# Altium schematic sheet ATLAS_XP2V5.Sheet 5.SchDoc: ATLAS_XP2V5
size 558 x 431 mm; Organization: IMP Automatika d.o.o.; Revision: V5
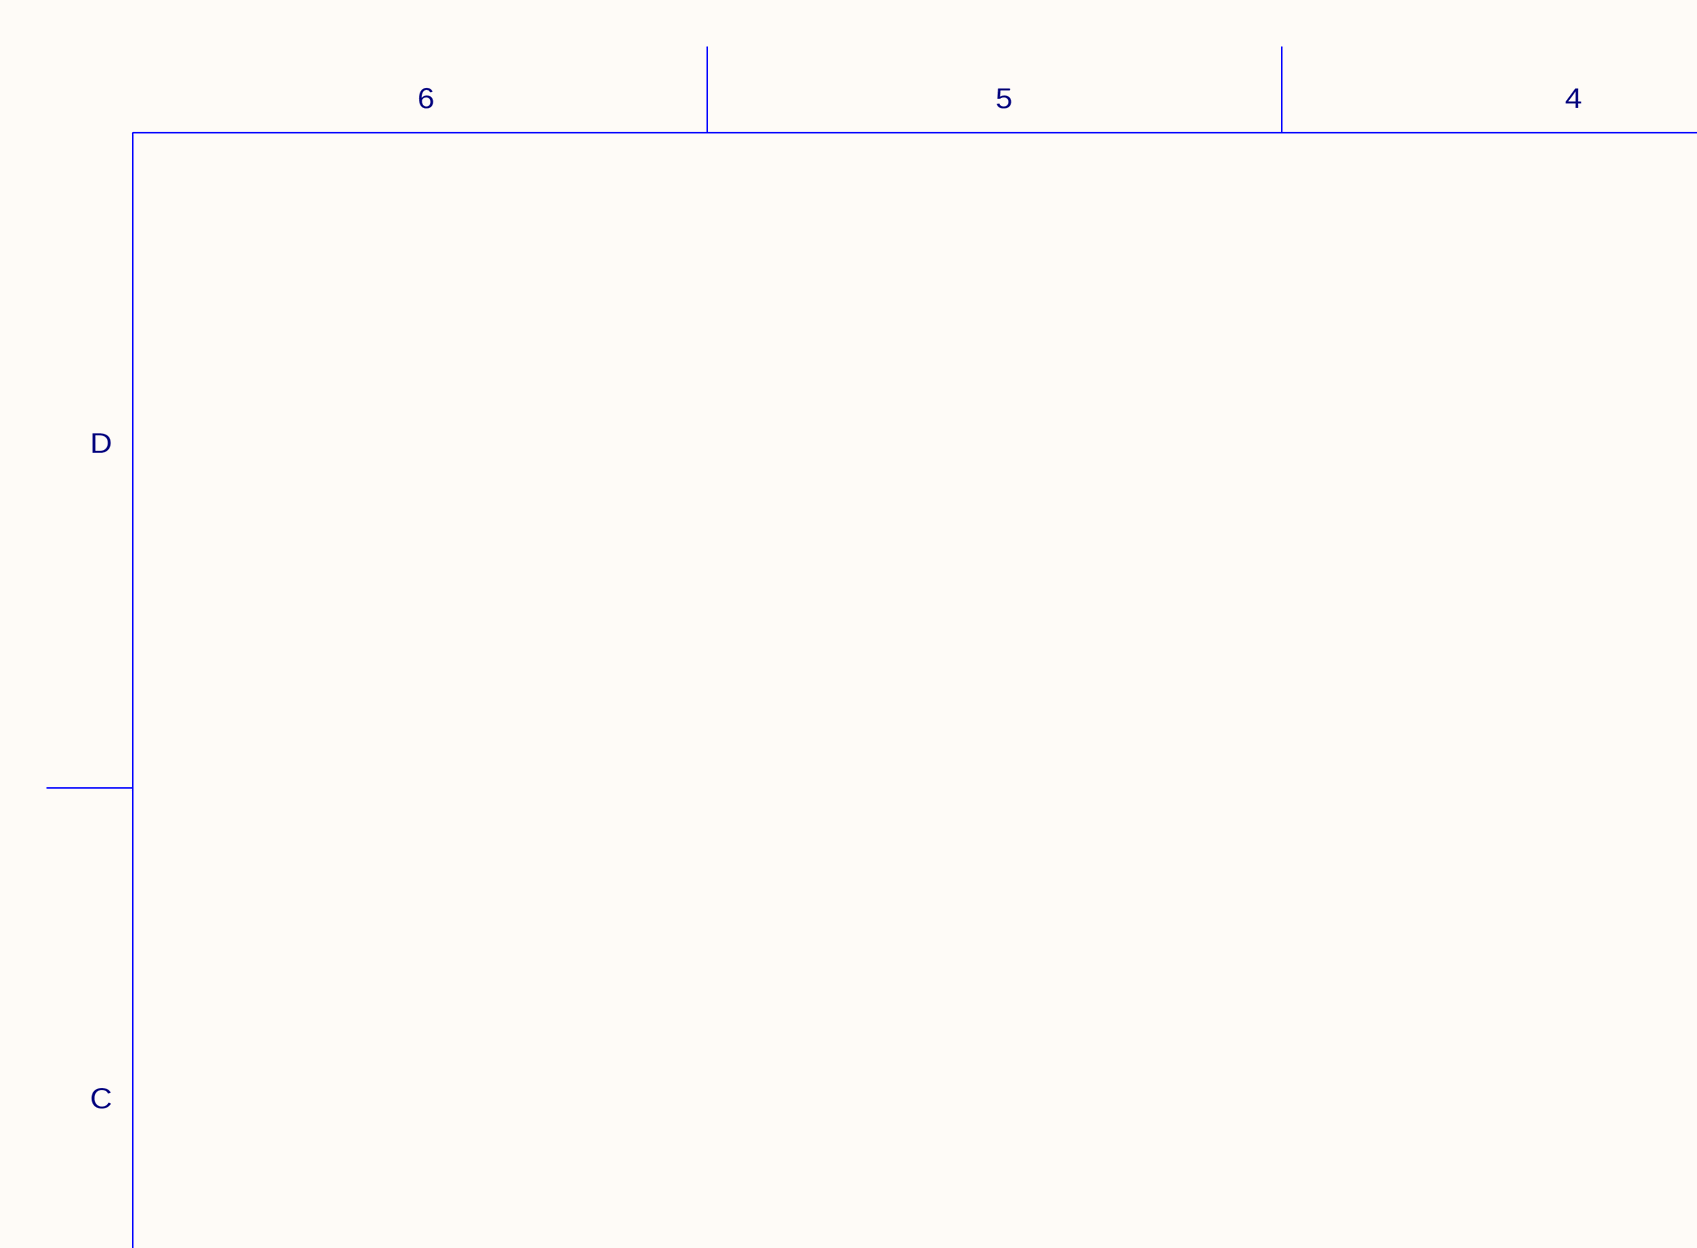
[diagram p0: ATLAS_XP2V5.Sheet 5.SchDoc, top left]
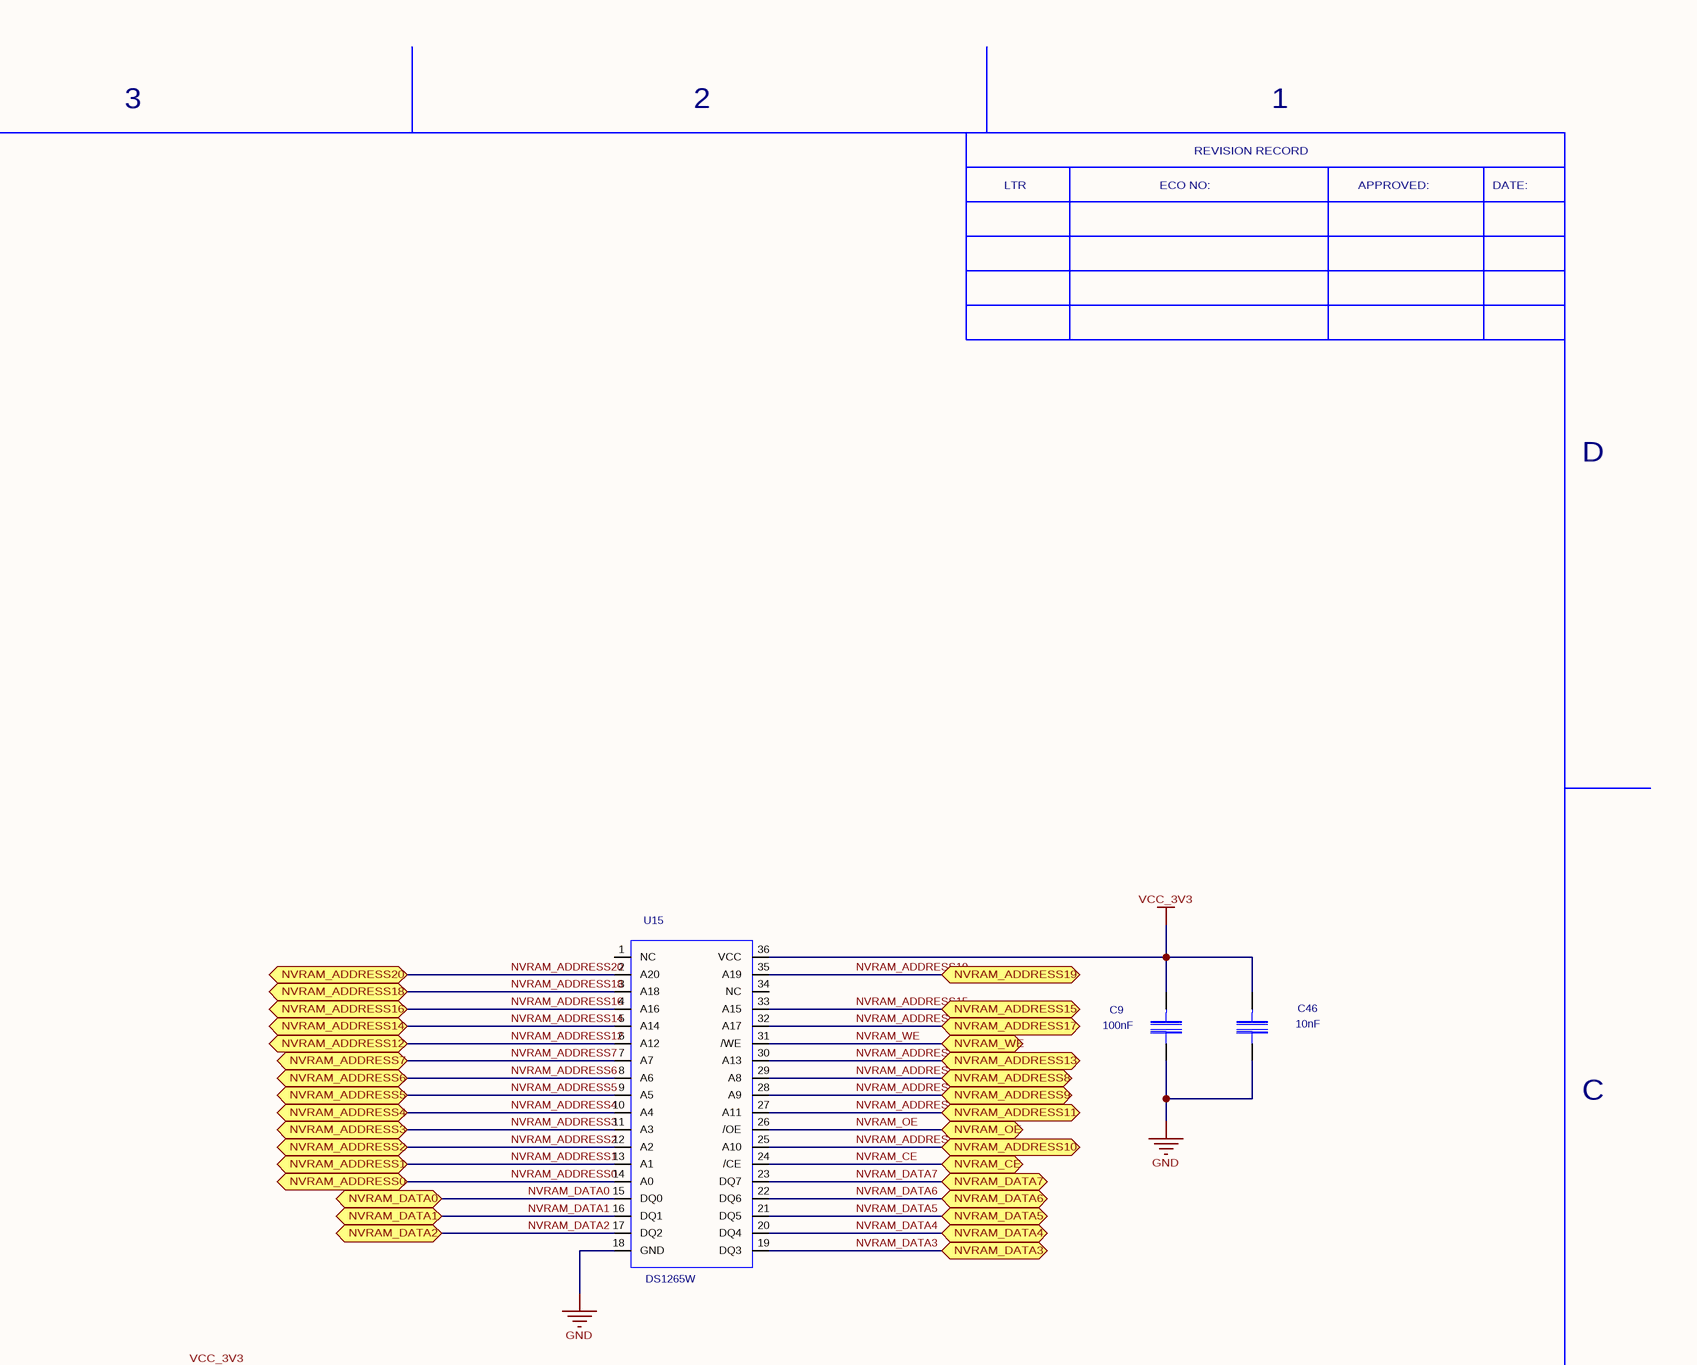
[diagram p1: ATLAS_XP2V5.Sheet 5.SchDoc, top right]
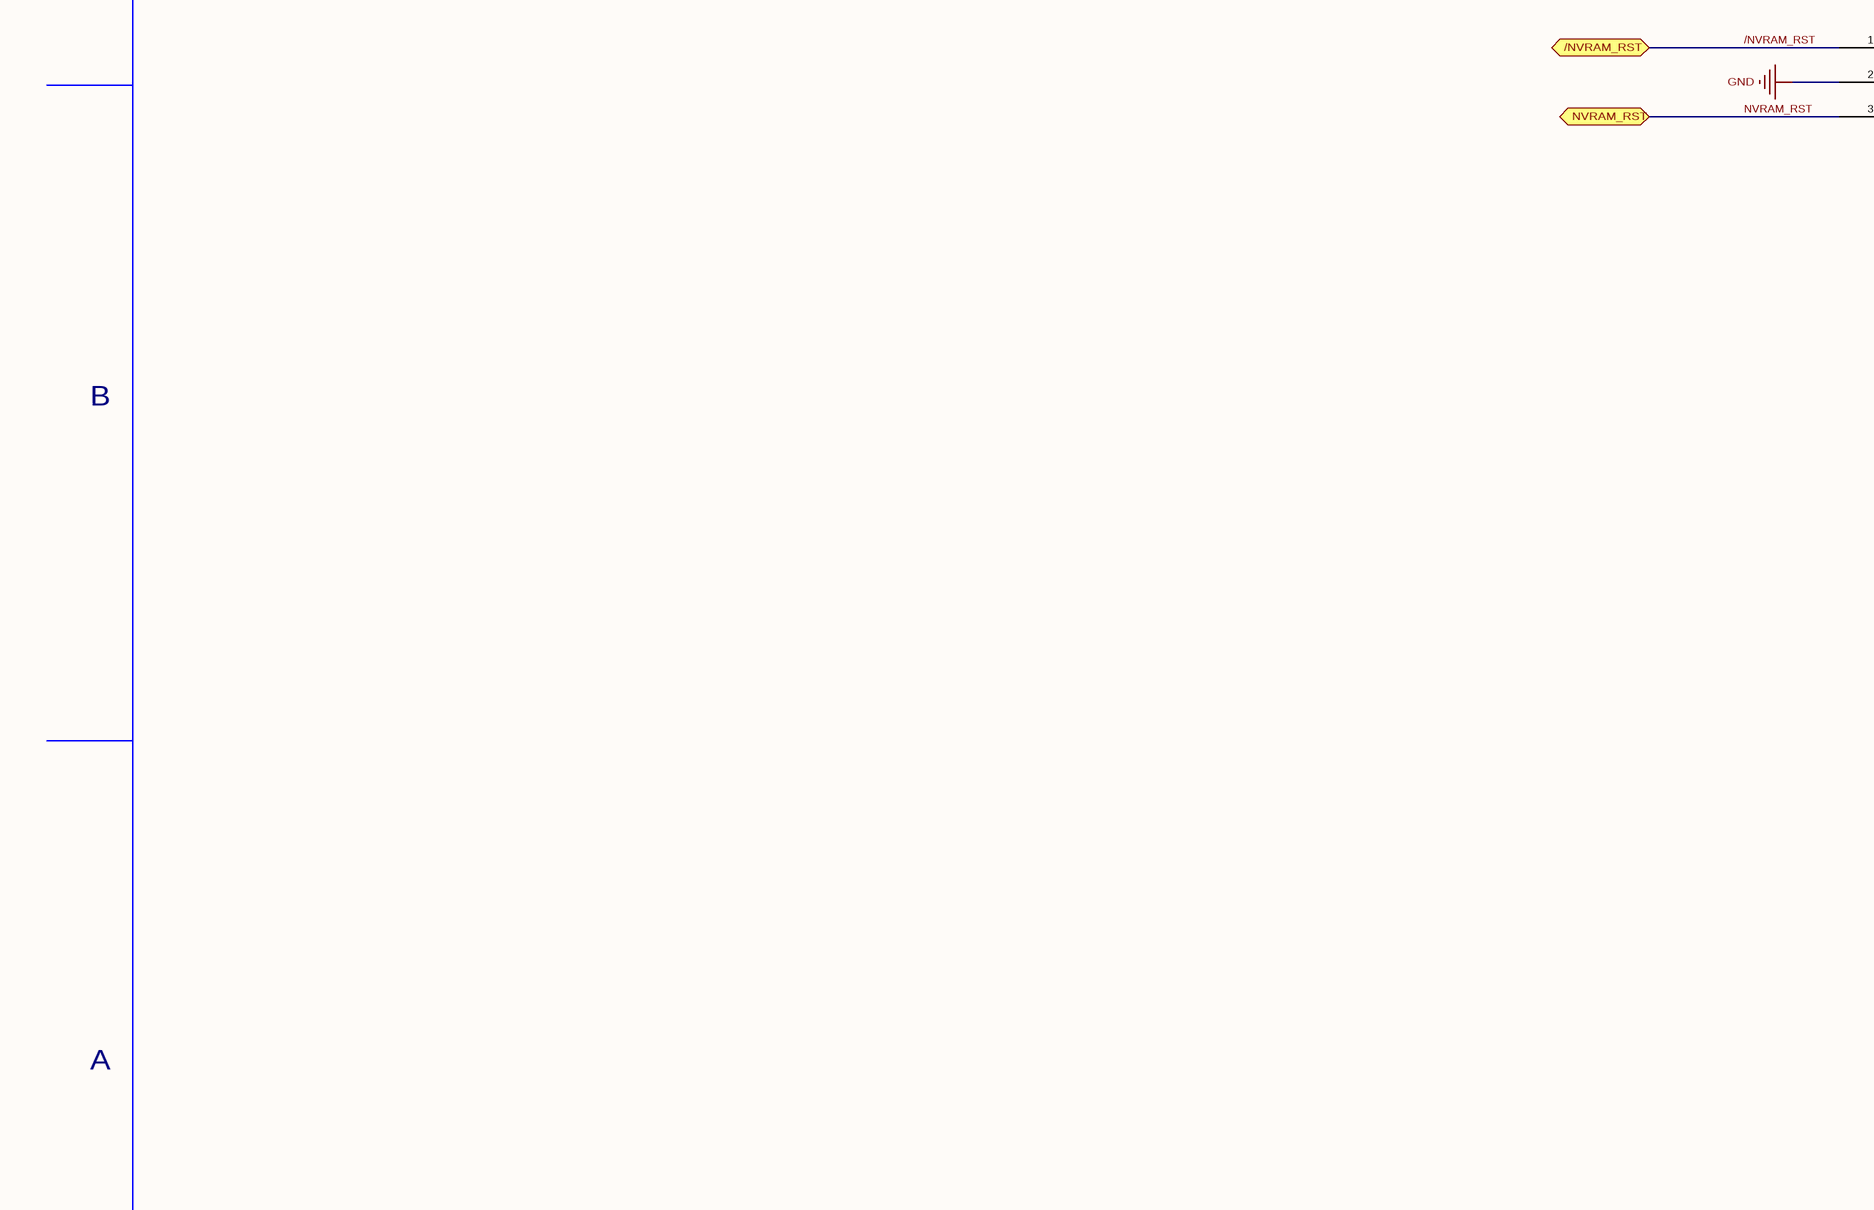
[diagram p2: ATLAS_XP2V5.Sheet 5.SchDoc, bottom left]
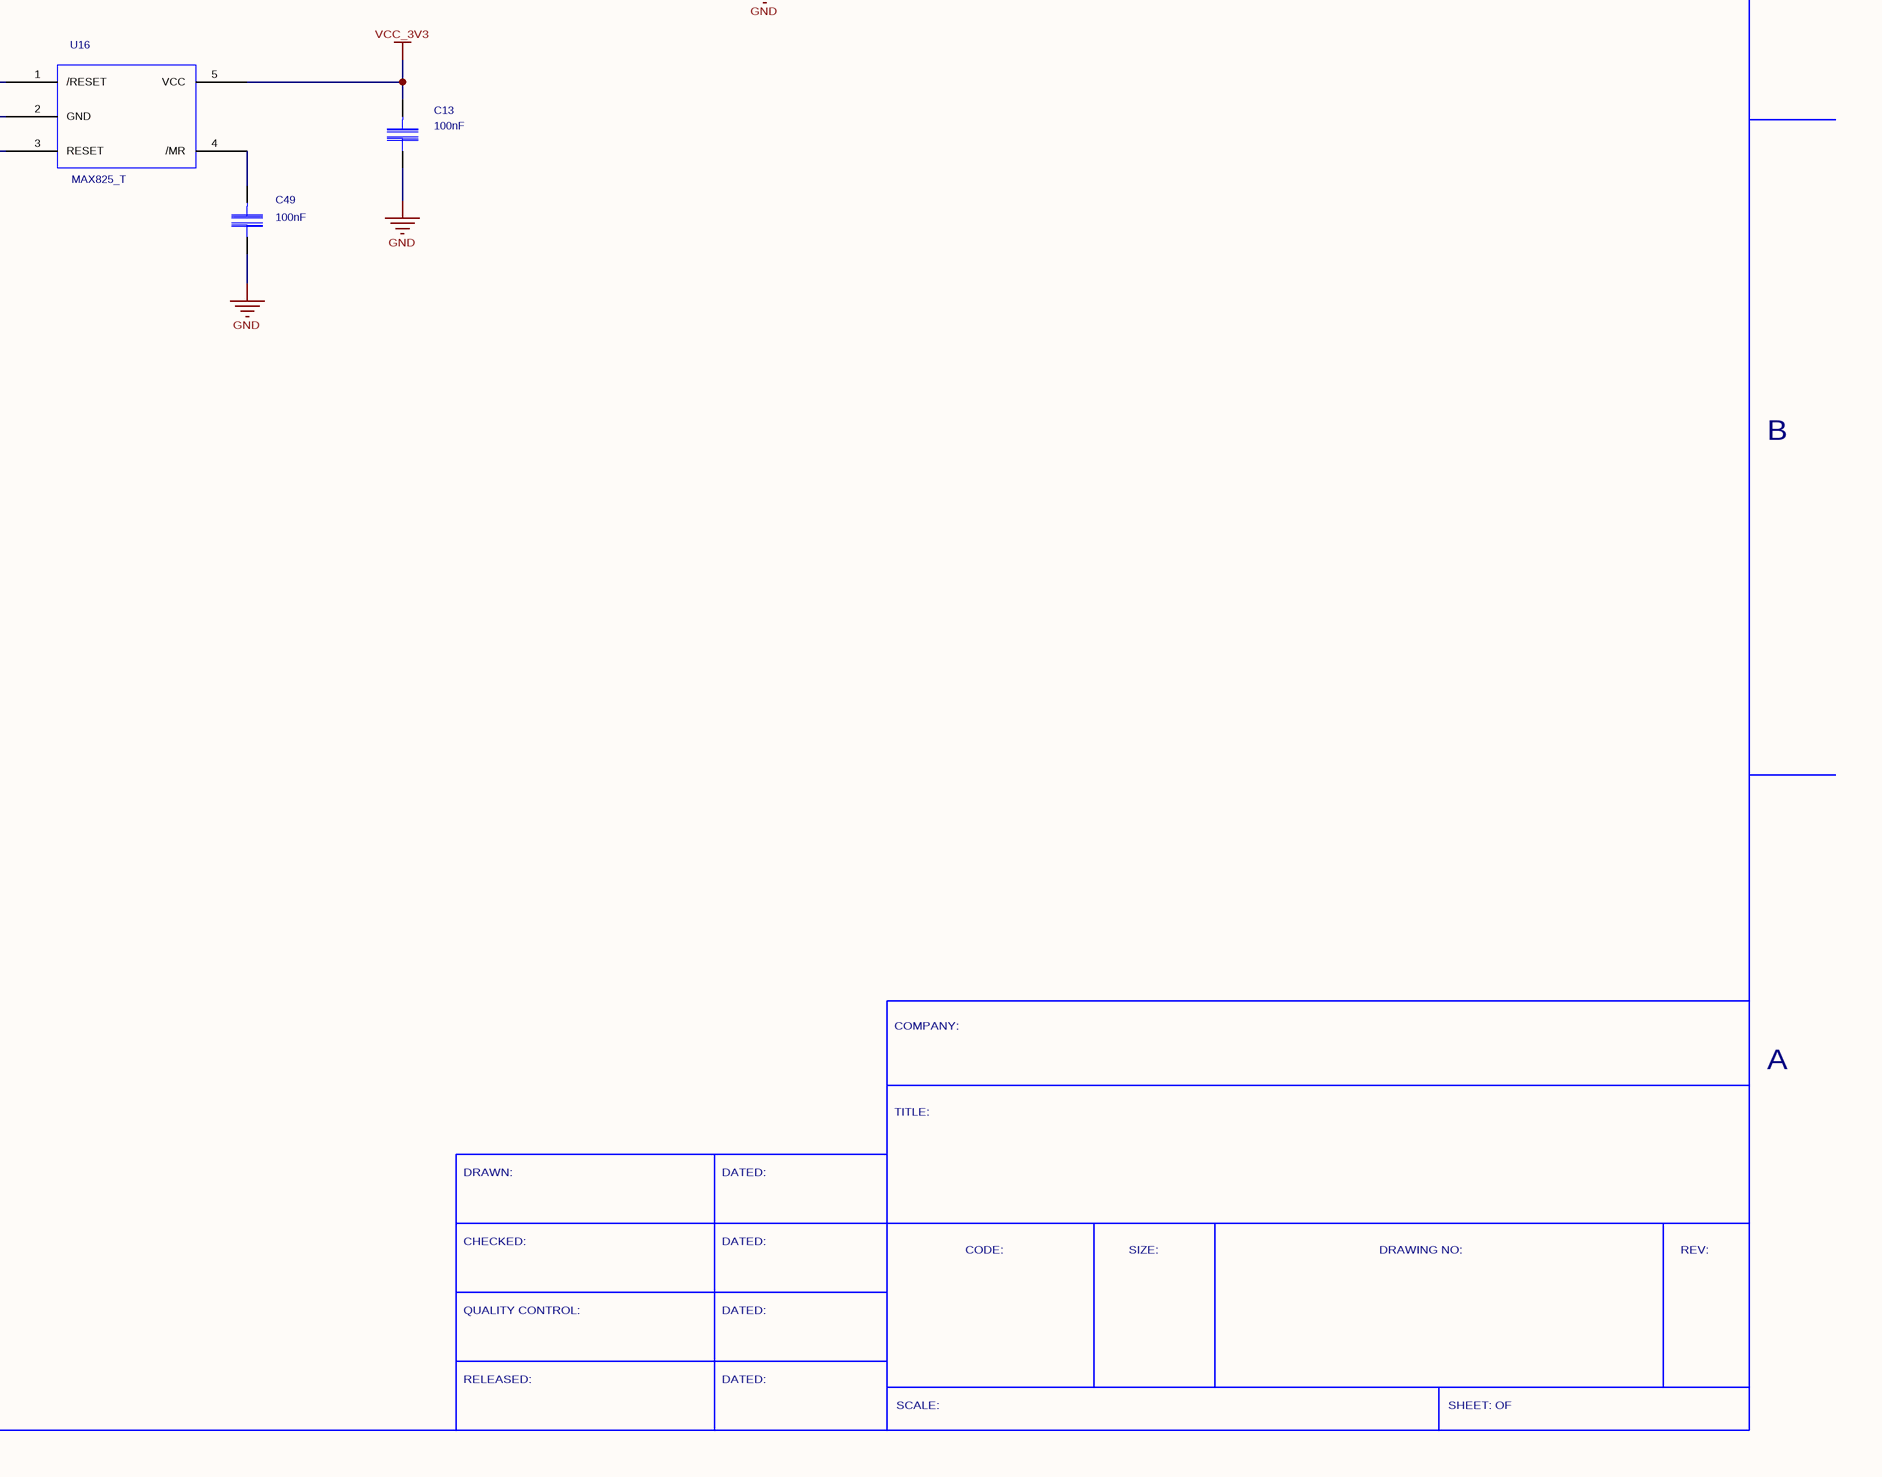
[diagram p3: ATLAS_XP2V5.Sheet 5.SchDoc, bottom right]

## Parts
C9  value 100nF  [SM/C_0805]  (hidden comment: C)
C13  value 100nF  [SM/C_0805]  (hidden comment: C)
C46  value 10nF  [SM/C_0805]  (hidden comment: C)
C49  value 100nF  [SM/C_0805]  (hidden comment: C)
U15  DS1265W  [DIP.100/36/W.600/L1.850]
U16  MAX825_T  [SOT23_5_MILOS_REV4]

## Ports
/NVRAM_RST (bidir), NVRAM_ADDRESS0 (bidir), NVRAM_ADDRESS1 (bidir), NVRAM_ADDRESS2 (bidir), NVRAM_ADDRESS3 (bidir), NVRAM_ADDRESS4 (bidir), NVRAM_ADDRESS5 (bidir), NVRAM_ADDRESS6 (bidir), NVRAM_ADDRESS7 (bidir), NVRAM_ADDRESS8 (bidir), NVRAM_ADDRESS9 (bidir), NVRAM_ADDRESS10 (bidir), NVRAM_ADDRESS11 (bidir), NVRAM_ADDRESS12 (bidir), NVRAM_ADDRESS13 (bidir), NVRAM_ADDRESS14 (bidir), NVRAM_ADDRESS15 (bidir), NVRAM_ADDRESS16 (bidir), NVRAM_ADDRESS17 (bidir), NVRAM_ADDRESS18 (bidir), NVRAM_ADDRESS19 (bidir), NVRAM_ADDRESS20 (bidir), NVRAM_CE (bidir), NVRAM_DATA0 (bidir), NVRAM_DATA1 (bidir), NVRAM_DATA2 (bidir), NVRAM_DATA3 (bidir), NVRAM_DATA4 (bidir), NVRAM_DATA5 (bidir), NVRAM_DATA6 (bidir), NVRAM_DATA7 (bidir), NVRAM_OE (bidir), NVRAM_RST (bidir), NVRAM_WE (bidir)

## Nets
GND: C9.2 C13.2 C46.2 C49.2 U15.18(GND) U16.2(GND)
VCC_3V3: C9.1 C13.1 C46.1 U15.36(VCC) U16.5(VCC)
/NVRAM_RST: U16.1(/RESET) ; port /NVRAM_RST
NVRAM_ADDRESS0: U15.14(A0) ; port NVRAM_ADDRESS0
NVRAM_ADDRESS1: U15.13(A1) ; port NVRAM_ADDRESS1
NVRAM_ADDRESS2: U15.12(A2) ; port NVRAM_ADDRESS2
NVRAM_ADDRESS3: U15.11(A3) ; port NVRAM_ADDRESS3
NVRAM_ADDRESS4: U15.10(A4) ; port NVRAM_ADDRESS4
NVRAM_ADDRESS5: U15.9(A5) ; port NVRAM_ADDRESS5
NVRAM_ADDRESS6: U15.8(A6) ; port NVRAM_ADDRESS6
NVRAM_ADDRESS7: U15.7(A7) ; port NVRAM_ADDRESS7
NVRAM_ADDRESS8: U15.29(A8) ; port NVRAM_ADDRESS8
NVRAM_ADDRESS9: U15.28(A9) ; port NVRAM_ADDRESS9
NVRAM_ADDRESS10: U15.25(A10) ; port NVRAM_ADDRESS10
NVRAM_ADDRESS11: U15.27(A11) ; port NVRAM_ADDRESS11
NVRAM_ADDRESS12: U15.6(A12) ; port NVRAM_ADDRESS12
NVRAM_ADDRESS13: U15.30(A13) ; port NVRAM_ADDRESS13
NVRAM_ADDRESS14: U15.5(A14) ; port NVRAM_ADDRESS14
NVRAM_ADDRESS15: U15.33(A15) ; port NVRAM_ADDRESS15
NVRAM_ADDRESS16: U15.4(A16) ; port NVRAM_ADDRESS16
NVRAM_ADDRESS17: U15.32(A17) ; port NVRAM_ADDRESS17
NVRAM_ADDRESS18: U15.3(A18) ; port NVRAM_ADDRESS18
NVRAM_ADDRESS19: U15.35(A19) ; port NVRAM_ADDRESS19
NVRAM_ADDRESS20: U15.2(A20) ; port NVRAM_ADDRESS20
NVRAM_CE: U15.24(/CE) ; port NVRAM_CE
NVRAM_DATA0: U15.15(DQ0) ; port NVRAM_DATA0
NVRAM_DATA1: U15.16(DQ1) ; port NVRAM_DATA1
NVRAM_DATA2: U15.17(DQ2) ; port NVRAM_DATA2
NVRAM_DATA3: U15.19(DQ3) ; port NVRAM_DATA3
NVRAM_DATA4: U15.20(DQ4) ; port NVRAM_DATA4
NVRAM_DATA5: U15.21(DQ5) ; port NVRAM_DATA5
NVRAM_DATA6: U15.22(DQ6) ; port NVRAM_DATA6
NVRAM_DATA7: U15.23(DQ7) ; port NVRAM_DATA7
NVRAM_OE: U15.26(/OE) ; port NVRAM_OE
NVRAM_RST: U16.3(RESET) ; port NVRAM_RST
NVRAM_WE: U15.31(/WE) ; port NVRAM_WE
NetC49_1: C49.1 U16.4(/MR)

Not connected (* = marked no-connect by the designer): U15 1(NC) 34(NC)

## Notes on the sheet
- 6
- 5
- 4
- 3
- 2
- 1
- LTR
- ECO NO:
- REVISION RECORD
- APPROVED:
- DATE:
- D
- C
- B
- COMPANY:
- A
- TITLE:
- DRAWN:
- DATED:
- CHECKED:
- CODE:
- SIZE:
- DRAWING NO:
- REV:
- QUALITY CONTROL:
- RELEASED:
- SCALE:
- SHEET: OF

## Library data of the parts
C9 C13 C46 C49 = C: Source_Path: D:\ORCADWIN\CAPTURE\ATP_LATT_01\ATP_00.OLB; SDTSourceLibName: C:\WINDOWS\TEMP\ATP_00.LIB; PCB DECAL: SM/C_0805
U15 = DS1265W: Source_Path: E:\MILOS\PROJECTS\ATLAS_XP2V3\DALLAS.OLB; PCB DECAL: DIP.100/36/W.600/L1.850; Value: DS1265W
U16 = MAX825_T: Source_Path: E:\MILOS\PROJECTS\ATLAS_XP2V3\ATLASXP.OLB; PCB DECAL: SOT23_5_MILOS_REV4; Value: MAX825_T